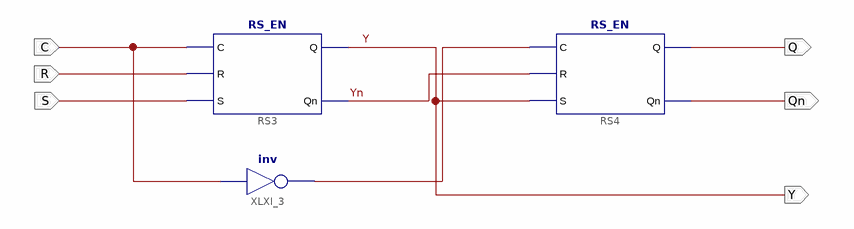
[diagram p0: schematic sheet 1]
// Xilinx ISE schematic RS_Tri.sch (kintex7) as structural Verilog: 3 symbols, 6 ports
module RS_Tri (
  input  R,
  input  S,
  input  C,
  output Y,
  output Qn,
  output Q
);

  wire XLXN_10, Yn;

  RS_EN RS3 (.C(C), .R(R), .S(S), .Q(Y), .Qn(Yn));
  RS_EN RS4 (.C(XLXN_10), .R(Yn), .S(Y), .Q(Q), .Qn(Qn));
  not XLXI_3 (XLXN_10, C);
endmodule
